# Altium schematic sheet 08_JTAG_DEBUG.SchDoc: XEM NC pins, JTAG and Debug I/O
size 381 x 266 mm; Organization: Meteroi; Address1: Room 428, 410 Guiping Rd.; Address2: Shanghai 200233, CHINA; SheetNumber: 8; SheetTotal: 9; PageSetup: Record=PageOptions|CenterHorizontal=True|CenterVertical=True|PrintScale=0.75|XCorrection=1.00|YCorrection=1.00|PrintKind=2|BorderSize=5000000|LeftOffset=0|BottomOffset=0|Orientation=2|PaperLength=1000|PaperWidth=1000|Scale=100|PaperSource=276|PrintQuality=-3|MediaType=1|DitherType=10|PaperKind=A4|PrintScaleMode=1
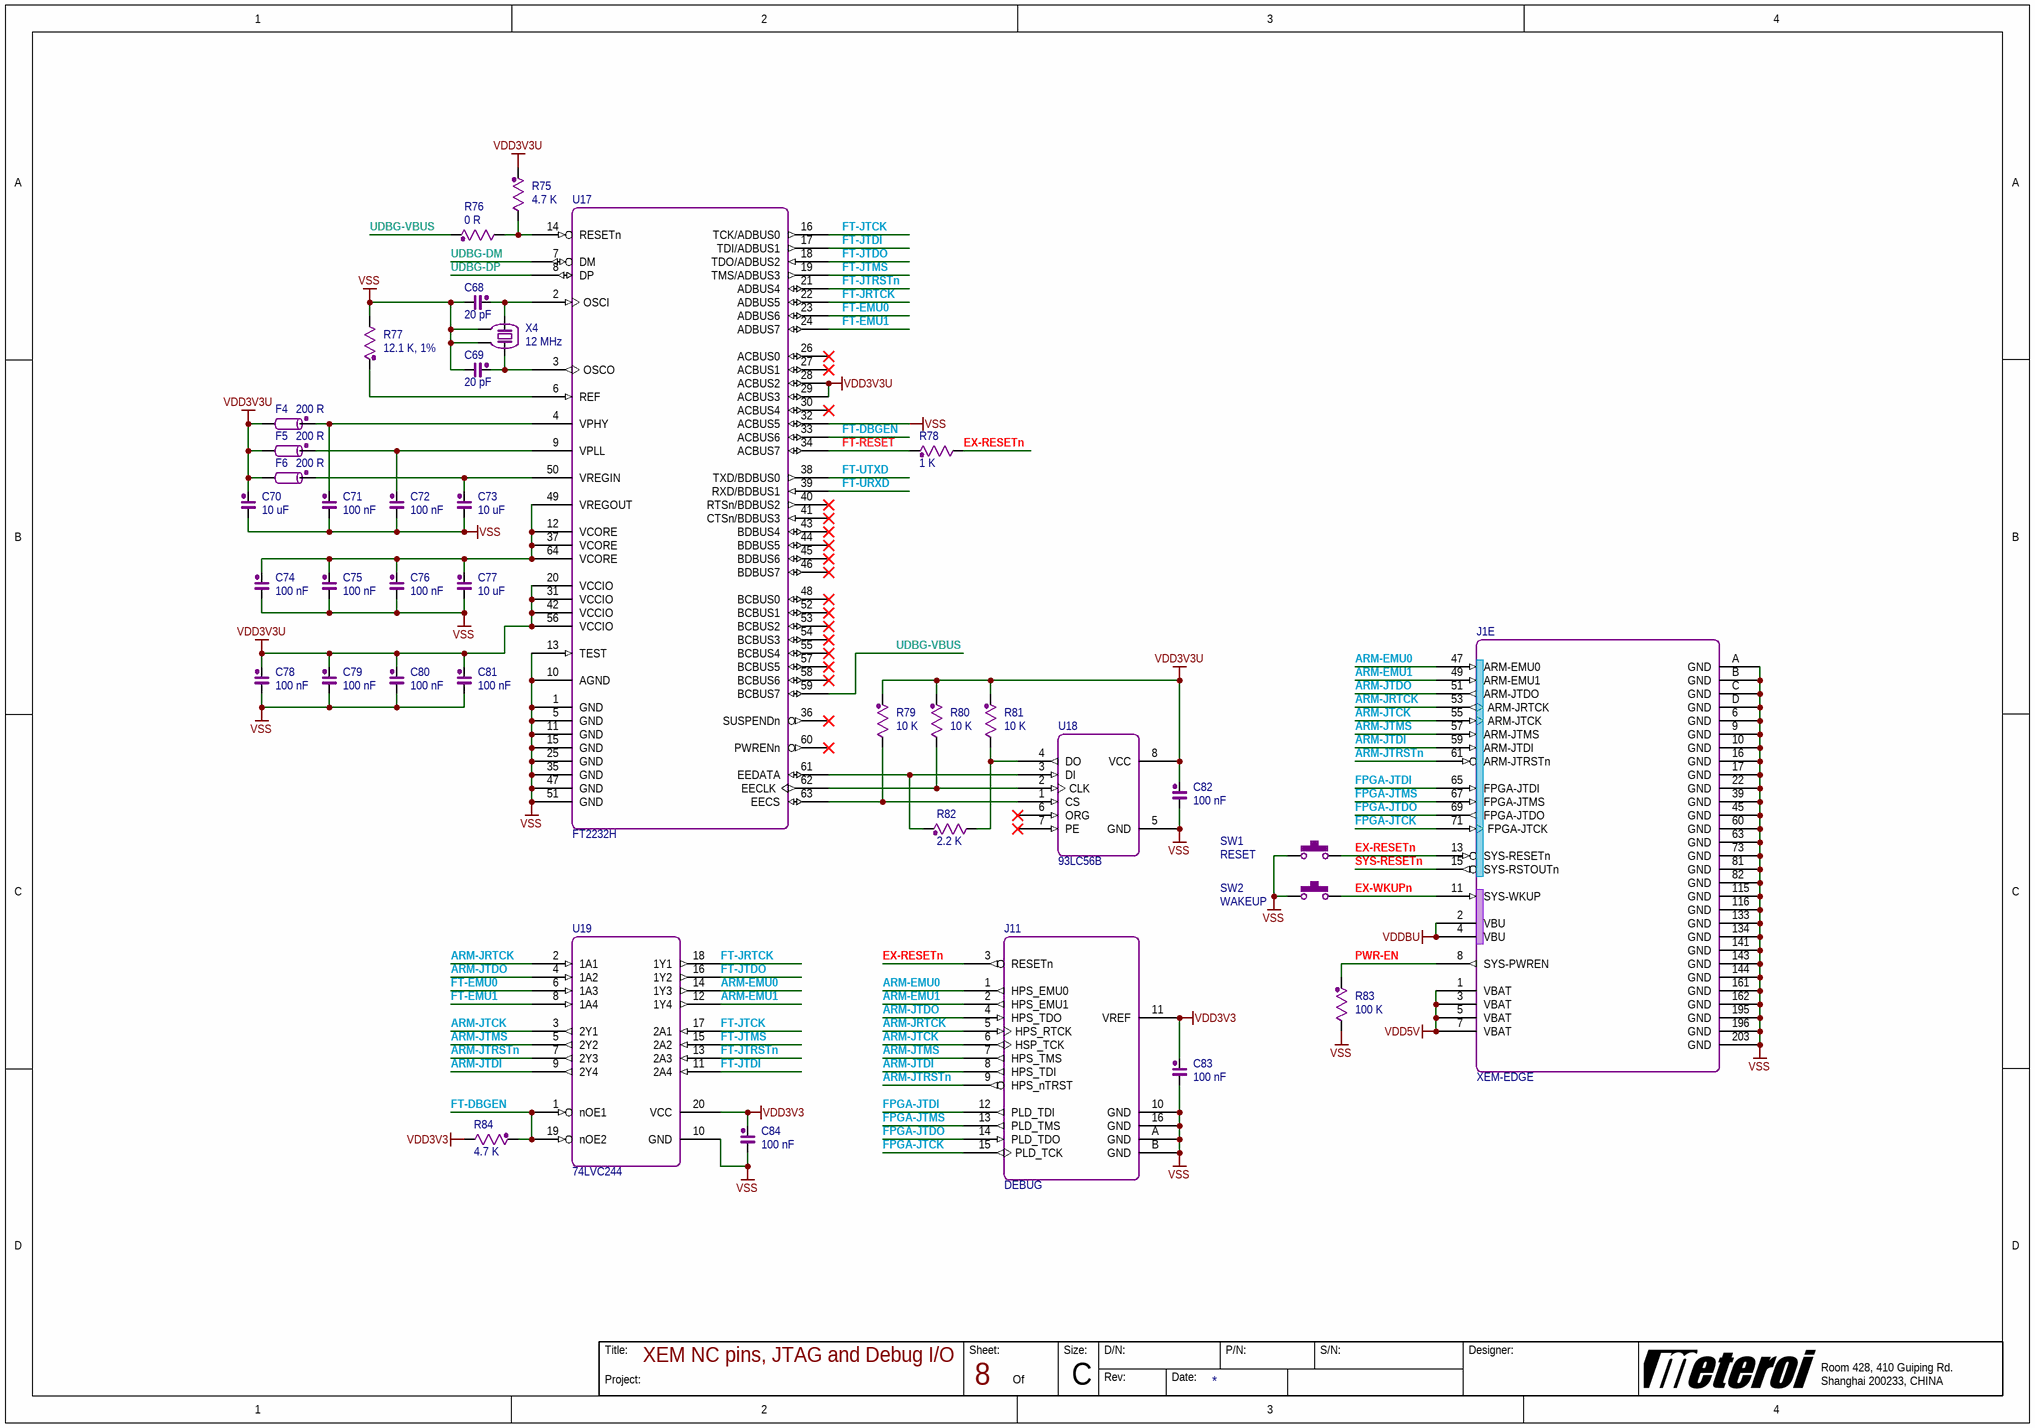
[diagram p0: 08_JTAG_DEBUG.SchDoc]

## Parts
C68  20 pF  [0402A1]
C69  20 pF  [0402A1]
C70  10 uF  [0603A1]
C71  100 nF  [0402A1]
C72  100 nF  [0402A1]
C73  10 uF  [0603A1]
C74  100 nF  [0402A1]
C75  100 nF  [0402A1]
C76  100 nF  [0402A1]
C77  10 uF  [0603A1]
C78  100 nF  [0402A1]
C79  100 nF  [0402A1]
C80  100 nF  [0402A1]
C81  100 nF  [0402A1]
C82  100 nF  [0402A1]
C83  100 nF  [0603A1]
C84  100 nF  [0402A1]
F4  200 R  [0603A3]
F5  200 R  [0603A3]
F6  200 R  [0603A3]
J1  XEM-EDGE  [XEM-1S-204]  (part E of 5)
J11  DEBUG  [HPI_1P25_RA16S]
R75  4.7 K  [0402A2]
R76  0 R  [0402A2]
R77  12.1 K, 1%  [0402A2]
R78  1 K  [0603A2]
R79  10 K  [0402A2]
R80  10 K  [0402A2]
R81  10 K  [0402A2]
R82  2.2 K  [0402A2]
R83  100 K  [0402A2]
R84  4.7 K  [0402A2]
SW1  RESET  [SW_TACT_P_06X06]
SW2  WAKEUP  [SW_TACT_P_06X06]
U17  FT2232H  [TQFP-64A]
U18  93LC56B  [SOIC-8S]
U19  74LVC244  [TSSOP-20]
X4  12 MHz  [OSC_4A_S_3225]

## Nets
VDD3V3: C83.2 C84.2 J11.11(VREF) R84.1 U19.20(VCC)
VDD3V3U: C70.2 C78.2 C79.2 C80.2 C81.2 C82.2 F4.1 F5.1 F6.1 R75.2 R79.2 R80.2 R81.2 U17.20(VCCIO) U17.28(ACBUS2) U17.29(ACBUS3) U17.31(VCCIO) U17.42(VCCIO) U17.56(VCCIO) U18.8(VCC)
VDD5V: J1.1(VBAT) J1.3(VBAT) J1.5(VBAT) J1.7(VBAT)
VDDBU: J1.2(VBU) J1.4(VBU)
VSS: C68.1 C69.1 C70.1 C71.1 C72.1 C73.1 C74.1 C75.1 C76.1 C77.1 C78.1 C79.1 C80.1 C81.1 C82.1 C83.1 C84.1 J1.6(GND) J1.9(GND) J1.10(GND) J1.16(GND) J1.17(GND) J1.22(GND) J1.39(GND) J1.45(GND) J1.60(GND) J1.63(GND) J1.73(GND) J1.81(GND) J1.82(GND) J1.115(GND) J1.116(GND) J1.133(GND) J1.134(GND) J1.141(GND) J1.143(GND) J1.144(GND) J1.161(GND) J1.162(GND) J1.195(GND) J1.196(GND) J1.203(GND) J1.A(GND) J1.B(GND) J1.C(GND) J1.D(GND) J11.10(GND) J11.16(GND) J11.A(GND) J11.B(GND) R77.1 R83.1 SW1.1(KA) SW2.1(KA) U17.1(GND) U17.5(GND) U17.10(AGND) U17.11(GND) U17.13(TEST) U17.15(GND) U17.25(GND) U17.32(ACBUS5) U17.35(GND) U17.47(GND) U17.51(GND) U18.5(GND) U19.10(GND) X4.2 X4.4
ARM-EMU0: J1.47(ARM-EMU0) J11.1(HPS_EMU0) U19.14(1Y3)
ARM-EMU1: J1.49(ARM-EMU1) J11.2(HPS_EMU1) U19.12(1Y4)
ARM-JRTCK: J1.53(ARM-JRTCK) J11.5(HPS_RTCK) U19.2(1A1)
ARM-JTCK: J1.55(ARM-JTCK) J11.6(HSP_TCK) U19.3(2Y1)
ARM-JTDI: J1.59(ARM-JTDI) J11.8(HPS_TDI) U19.9(2Y4)
ARM-JTDO: J1.51(ARM-JTDO) J11.4(HPS_TDO) U19.4(1A2)
ARM-JTMS: J1.57(ARM-JTMS) J11.7(HPS_TMS) U19.5(2Y2)
ARM-JTRSTn: J1.61(ARM-JTRSTn) J11.9(HPS_nTRST) U19.7(2Y3)
EX-RESETn: J1.13(SYS-RESETn) J11.3(RESETn) R78.1 SW1.2(KB)
EX-WKUPn: J1.11(SYS-WKUP) SW2.2(KB)
FPGA-JTCK: J1.71(FPGA-JTCK) J11.15(PLD_TCK)
FPGA-JTDI: J1.65(FPGA-JTDI) J11.12(PLD_TDI)
FPGA-JTDO: J1.69(FPGA-JTDO) J11.14(PLD_TDO)
FPGA-JTMS: J1.67(FPGA-JTMS) J11.13(PLD_TMS)
FT-DBGEN: R84.2 U17.33(ACBUS6) U19.1(nOE1) U19.19(nOE2)
FT-EMU0: U17.23(ADBUS6) U19.6(1A3)
FT-EMU1: U17.24(ADBUS7) U19.8(1A4)
FT-JRTCK: U17.22(ADBUS5) U19.18(1Y1)
FT-JTCK: U17.16(TCK/ADBUS0) U19.17(2A1)
FT-JTDI: U17.17(TDI/ADBUS1) U19.11(2A4)
FT-JTDO: U17.18(TDO/ADBUS2) U19.16(1Y2)
FT-JTMS: U17.19(TMS/ADBUS3) U19.15(2A2)
FT-JTRSTn: U17.21(ADBUS4) U19.13(2A3)
FT-RESET: R78.2 U17.34(ACBUS7)
FT-URXD: U17.39(RXD/BDBUS1)
FT-UTXD: U17.38(TXD/BDBUS0)
PWR-EN: J1.8(SYS-PWREN) R83.2
SYS-RESETn: J1.15(SYS-RSTOUTn)
UDBG-DM: U17.7(DM)
UDBG-DP: U17.8(DP)
UDBG-VBUS: R76.2 U17.59(BCBUS7)
NetC68_2: C68.2 U17.2(OSCI) X4.1
NetC69_2: C69.2 U17.3(OSCO) X4.3
NetC71_2: C71.2 F4.2 U17.4(VPHY)
NetC72_2: C72.2 F5.2 U17.9(VPLL)
NetC73_2: C73.2 F6.2 U17.50(VREGIN)
NetC74_2: C74.2 C75.2 C76.2 C77.2 U17.12(VCORE) U17.37(VCORE) U17.49(VREGOUT) U17.64(VCORE)
NetR75_1: R75.1 R76.1 U17.14(RESETn)
NetR77_2: R77.2 U17.6(REF)
NetR79_1: R79.1 U17.63(EECS) U18.1(CS)
NetR80_1: R80.1 U17.62(EECLK) U18.2(CLK)
NetR81_1: R81.1 R82.1 U18.4(DO)
NetR82_2: R82.2 U17.61(EEDATA) U18.3(DI)

Not connected (* = marked no-connect by the designer): U17 26(ACBUS0)* 27(ACBUS1)* 30(ACBUS4)* 36(SUSPENDn)* 40(RTSn/BDBUS2)* 41(CTSn/BDBUS3)* 43(BDBUS4)* 44(BDBUS5)* 45(BDBUS6)* 46(BDBUS7)* 48(BCBUS0)* 52(BCBUS1)* 53(BCBUS2)* 54(BCBUS3)* 55(BCBUS4)* 57(BCBUS5)* 58(BCBUS6)* 60(PWRENn)*; U18 6(ORG)* 7(PE)*

## Notes on the sheet
- Title:
- Project:
- Sheet:
- Of
- Size:
- D/N:
- Rev:
- Date:
- P/N:
- S/N:
- Designer:
- C

## Library data of the parts
C68-C84 = CAP: Normal Capacitor; PartNumber: 0; Vendor: muRata; Designer: shyul; PinCountSMD: 2; SerialNumber: 0; Publisher: Cowin; PCBMarker: Capacitor; Version: 1.0; VersionDate: 04-27-2011; PinCountHole: 0
  C68 C69: Value: 20 pF
  C70 C73 C77: Value: 10 uF
  C71 C72 C74-C76 C78-C84: Value: 100 nF
F4-F6 = BEAD: EMI Bead; PartNumber: BLM; SerialNumber: 0; Vendor: muRata; Designer: shyul; PinCountSMD: 2; PCBMarker: Bead; Version: 1.0; Value: 200 R; VersionDate: 04-28-2011; Publisher: Cowin; PinCountHole: 0
J1 = XEM-SLOT: XEM Edge Connector 204-pins; Vendor: Cowin; PinCountSMD: 0; Designer: shyul; Value: XEM-EDGE; PartNumber: XEM-EDGE; Version: 1.0; VersionDate: 03-09-2012; PinCountHole: 0; SerialNumber: 0; Publisher: Cowin; PCBMarker: XEM
J11 = LOP_DEBUG: JTAG HPI Header; SerialNumber: 0; Vendor: Tyco; Designer: shyul; PCBMarker: DEBUG; PartNumber: DEBUG; Version: 1.0; VersionDate: 03-30-2012; Value: DEBUG; Publisher: Cowin; PinCountHole: 0
R75-R84 = RES: Normal Resistor; PartNumber: 0; Vendor: KOA; Designer: shyul; PinCountSMD: 2; SerialNumber: 0; Version: 1.0; VersionDate: 04-27-2011; PCBMarker: Resistor; Publisher: Cowin; PinCountHole: 0
  R75 R84: Value: 4.7 K
  R76: Value: 0 R
  R77: Value: 12.1 K, 1%
  R78: Value: 1 K
  R79-R81: Value: 10 K
  R82: Value: 2.2 K
  R83: Value: 100 K
SW1 SW2 = SW_TACT_A: Tactile Switch; PartNumber: B3F; Designer: shyul; Vendor: OMRON; SerialNumber: 0; Value: B3F; PCBMarker: Button; Version: 1.0; VersionDate: 05-05-2011; Publisher: Cowin
  SW1: Status: RESET
  SW2: Status: WAKEUP
U17 = FT2232H: USB to JTAG/UART; PartNumber: FT2232HL; Vendor: FTDI; PinCountSMD: 64; PinCountHole: 0; Designer: shyul; PCBMarker: 2232; Value: FT2232H; Version: 1.0; VersionDate: 03-26-2012; SerialNumber: 0; Publisher: Cowin
U18 = ROM_MWIRE: Generic Micro Wire ROM; PartNumber: 93LC56BISN; Vendor: Microchip; SerialNumber: 0; PCBMarker: Micro Wire Serial ROM; PinCountSMD: 8; Designer: shyul; Value: 93LC56B; Version: 1.0; VersionDate: 06-05-2011; Publisher: Cowin; PinCountHole: 0
U19 = 74_244: 8-Bit Driver; PartNumber: SN74LVC244APW; Vendor: TI; PCBMarker: 244 Driver; Designer: shyul; PinCountSMD: 20; PinCountHole: 0; Value: 74LVC244; Version: 1.0; VersionDate: 07-20-2011; Publisher: Cowin; SerialNumber: 0
X4 = OSC_2B: Crystal; PartNumber: 0; Vendor: KDS; Designer: shyul; PinCountSMD: 4; Value: 12 MHz; SerialNumber: 0; Publisher: Cowin; PCBMarker: Crystal; Version: 1.0; VersionDate: 04-29-2011; PinCountHole: 0